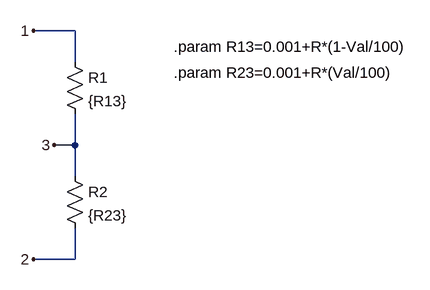
[diagram p0: schematic pot.asc]
pot.asc, the LTspice schematic file:
Version 4
SHEET 1 880 680
WIRE -16 0 -80 0
WIRE -16 48 -16 0
WIRE -16 176 -16 128
WIRE -16 176 -48 176
WIRE -16 224 -16 176
WIRE -16 352 -16 304
WIRE -16 352 -80 352
FLAG -80 0 1
FLAG -48 176 3
FLAG -80 352 2
SYMBOL res -32 32 R0
SYMATTR InstName R1
SYMATTR Value {R13}
SYMBOL res -32 208 R0
SYMATTR InstName R2
SYMATTR Value {R23}
TEXT 136 24 Left 2 !.param R13=0.001+R*(1-Val/100)
TEXT 136 64 Left 2 !.param R23=0.001+R*(Val/100)

The netlist it stands for:
* pot.asc
R1 1 3 {R13}
R2 3 2 {R23}
.param R13=0.001+R*(1-Val/100)
.param R23=0.001+R*(Val/100)
.backanno
.end